# Altium schematic sheet arm_mcu.SchDoc
size A4; Author: Suraj; DrawnBy: Suraj; Engineer: Suraj; Organization: Simcons Control Systems; Address1: Kalamassery; Address2: Cochin; Address4: India
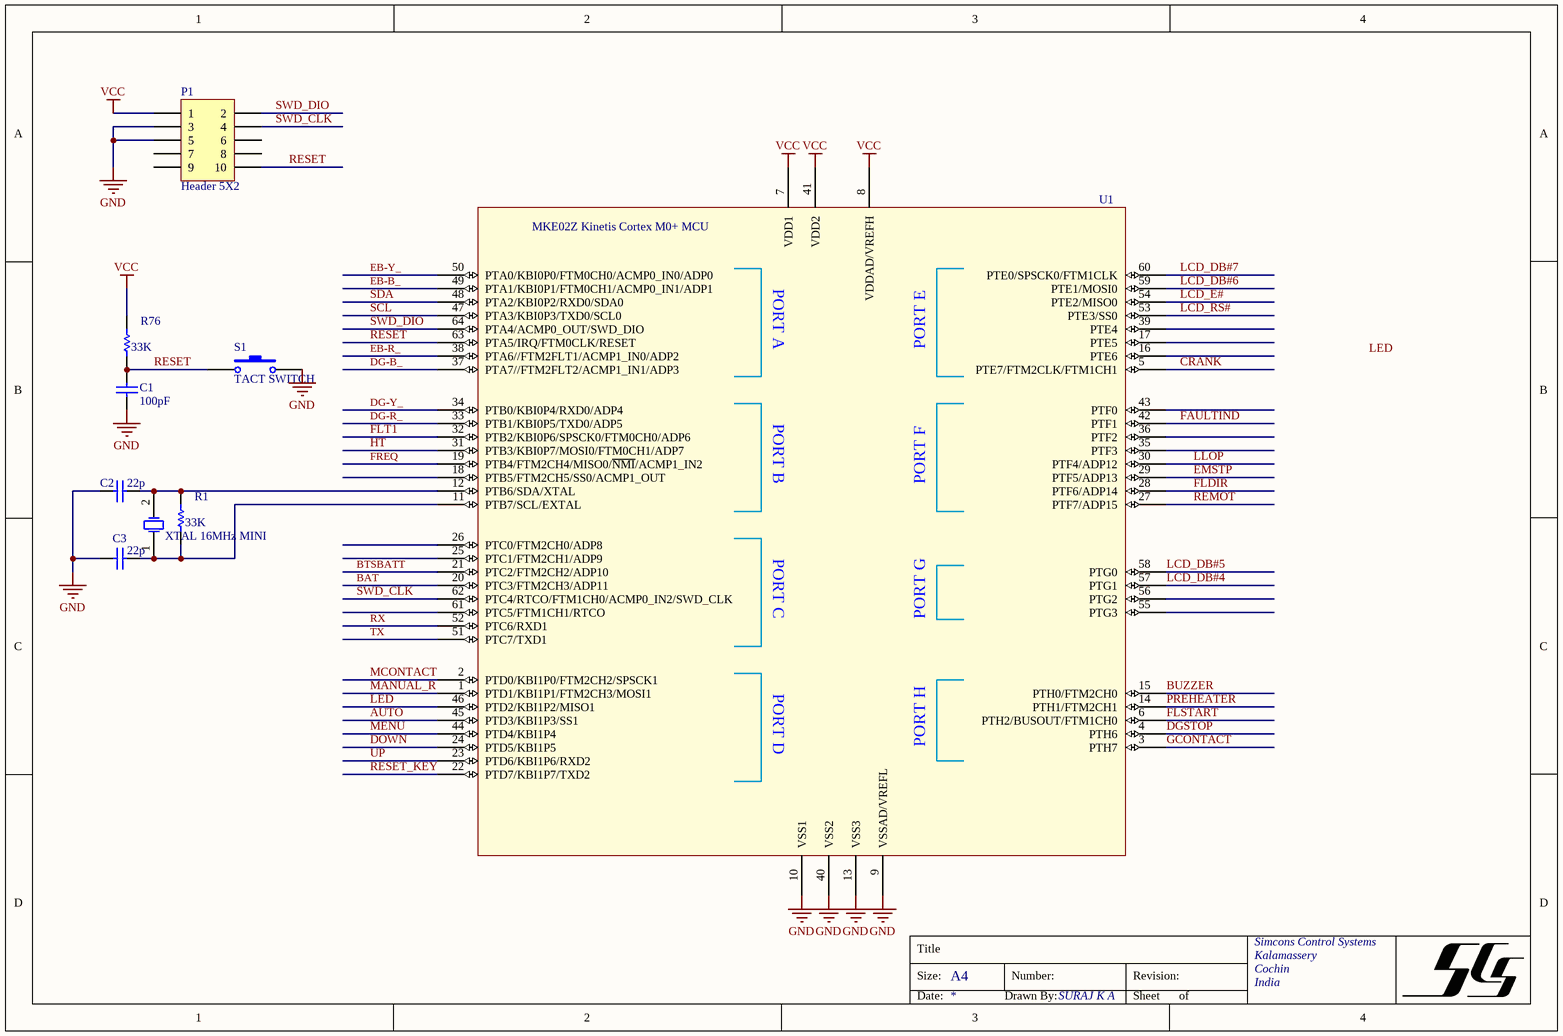
[diagram p0: arm_mcu.SchDoc]

## Parts
C1  value 100pF  [C1206_W]  (hidden comment: .1uF 1206)
C2  value 22p  [C1206_W]  (hidden comment: 22pF 1206)
C3  value 22p  [C1206_W]  (hidden comment: 22pF 1206)
P1  Header 5X2  [HDR2X5]
R1  value 33K  [R1206_W]  (hidden comment: 100K 1206)
R76  value 33K  [R1206_W]  (hidden comment: 100K 1206)
S1  TACT SWITCH  [SWSMALL]
U1  MKE02Z Kinetis Cortex M0+ MCU  [PLQP0064GA-A_M]
Y1  XTAL 16MHz MINI  [XTAL]

## Nets
GND: C1.1 C2.1 C3.1 P1.3 P1.5 S1.2 U1.9(VSSAD/VREFL) U1.10(VSS1) U1.13(VSS3) U1.40(VSS2)
VCC: P1.1 R76.1 U1.7(VDD1) U1.8(VDDAD/VREFH) U1.41(VDD2)
AUTO: U1.45(PTD3/KBI1P3/SS1)
BAT: U1.20(PTC3/FTM2CH3/ADP11)
BTSBATT: U1.21(PTC2/FTM2CH2/ADP10)
BUZZER: U1.15(PTH0/FTM2CH0)
CRANK: U1.5(PTE7/FTM2CLK/FTM1CH1)
DG-B_: U1.37(PTA7//FTM2FLT2/ACMP1_IN1/ADP3)
DG-R_: U1.33(PTB1/KBI0P5/TXD0/ADP5)
DG-Y_: U1.34(PTB0/KBI0P4/RXD0/ADP4)
DGSTOP: U1.4(PTH6)
DOWN: U1.24(PTD5/KBI1P5)
EB-B_: U1.49(PTA1/KBI0P1/FTM0CH1/ACMP0_IN1/ADP1)
EB-R_: U1.38(PTA6//FTM2FLT1/ACMP1_IN0/ADP2)
EB-Y_: U1.50(PTA0/KBI0P0/FTM0CH0/ACMP0_IN0/ADP0)
EMSTP: U1.29(PTF5/ADP13)
FAULTIND: U1.42(PTF1)
FLDIR: U1.28(PTF6/ADP14)
FLSTART: U1.6(PTH2/BUSOUT/FTM1CH0)
FLT1: U1.32(PTB2/KBI0P6/SPSCK0/FTM0CH0/ADP6)
FREQ: U1.19(PTB4/FTM2CH4/MISO0/~{NMI}/ACMP1_IN2)
GCONTACT: U1.3(PTH7)
HT: U1.31(PTB3/KBI0P7/MOSI0/FTM0CH1/ADP7)
LCD_DB#4: U1.57(PTG1)
LCD_DB#5: U1.58(PTG0)
LCD_DB#6: U1.59(PTE1/MOSI0)
LCD_DB#7: U1.60(PTE0/SPSCK0/FTM1CLK)
LCD_E#: U1.54(PTE2/MISO0)
LCD_RS#: U1.53(PTE3/SS0)
LED: U1.46(PTD2/KBI1P2/MISO1)
LLOP: U1.30(PTF4/ADP12)
MANUAL_R: U1.1(PTD1/KBI1P1/FTM2CH3/MOSI1)
MCONTACT: U1.2(PTD0/KBI1P0/FTM2CH2/SPSCK1)
MENU: U1.44(PTD4/KBI1P4)
PREHEATER: U1.14(PTH1/FTM2CH1)
REMOT: U1.27(PTF7/ADP15)
RESET: C1.2 P1.10 R76.2 S1.1 U1.63(PTA5/IRQ/FTM0CLK/RESET)
RESET_KEY: U1.22(PTD7/KBI1P7/TXD2)
RX: U1.52(PTC6/RXD1)
SCL: U1.47(PTA3/KBI0P3/TXD0/SCL0)
SDA: U1.48(PTA2/KBI0P2/RXD0/SDA0)
SWD_CLK: P1.4 U1.62(PTC4/RTCO/FTM1CH0/ACMP0_IN2/SWD_CLK)
SWD_DIO: P1.2 U1.64(PTA4/ACMP0_OUT/SWD_DIO)
TX: U1.51(PTC7/TXD1)
UP: U1.23(PTD6/KBI1P6/RXD2)
NetC2_2: C2.2 R1.1 U1.12(PTB6/SDA/XTAL) Y1.2(OSC2)
NetC3_2: C3.2 R1.2 U1.11(PTB7/SCL/EXTAL) Y1.1(OSC1)

Not connected (* = marked no-connect by the designer): P1 6 7 8 9; U1 16(PTE6) 17(PTE5) 18(PTB5/FTM2CH5/SS0/ACMP1_OUT) 25(PTC1/FTM2CH1/ADP9) 26(PTC0/FTM2CH0/ADP8) 35(PTF3) 36(PTF2) 39(PTE4) 43(PTF0) 55(PTG3) 56(PTG2) 61(PTC5/FTM1CH1/RTCO)

## Notes on the sheet
- Labels drawn without touching a wire or pin: LED
- Title
- Size:
- A4
- Number:
- Revision:
- Simcons Control Systems
- Kalamassery
- Cochin
- India
- Date:
- Drawn By:
- SURAJ K A
- Sheet
- of
- (in symbol MKE02Z64) PORT A; PORT E; PORT B; PORT F; PORT C; PORT G; PORT D; PORT H

## Library data of the parts
C1-C3 = Cap: Capacitor; Published: 8-Jun-2000; LatestRevisionDate: 17-Jul-2002; LatestRevisionNote: Re-released for DXP Platform.; PackageReference: RAD-0.3; Publisher: Altium Limited; PackageDescription: Radial Cap, Thru-Hole; 2 Leads; 0.3 in Pin Spacing
P1 = Header 5X2: Header, 5-Pin, Dual row; LatestRevisionDate: 17-Jul-2002; LatestRevisionNote: Re-released for DXP Platform.; Publisher: Altium Limited
R1 R76 = Res1: Resistor; Published: 8-Jun-2000; LatestRevisionDate: 17-Jul-2002; LatestRevisionNote: Re-released for DXP Platform.; PackageReference: AXIAL-0.4; Publisher: Altium Limited; PackageDescription: Axial Device, Thru-Hole; 2 Leads; 0.3 in Pin Spacing
S1 = SW-PB: Switch; Published: 24-Mar-1999; LatestRevisionDate: 17-Jul-2002; LatestRevisionNote: Re-released for DXP Platform.; PackageReference: SPST-2; Publisher: Altium Limited; PackageDescription: Switch; 2 Leads
U1 = MKE02Z64: 32-Bit ARM Cortex M0+ RISC Core, 64KB Program Flash, 256B EEPROM, 4KB RAM, 64-Pin LQFP
Y1 = XTAL: Crystal Oscillator; Published: 8-Jun-2000; LatestRevisionDate: 17-Jul-2002; LatestRevisionNote: Re-released for DXP Platform.; PackageReference: R38; Publisher: Altium Limited; PackageDescription: Crystal, Thru-Hole; 2 Leads; Body 3.1 x 8.2 mm (Dia.xH)